# Altium project MEC.PrjPcb (part 2 of 2)

## Sheet Ethernet Interface (ETH).SchDoc
size A4; SheetNumber: 9; SheetTotal: 10
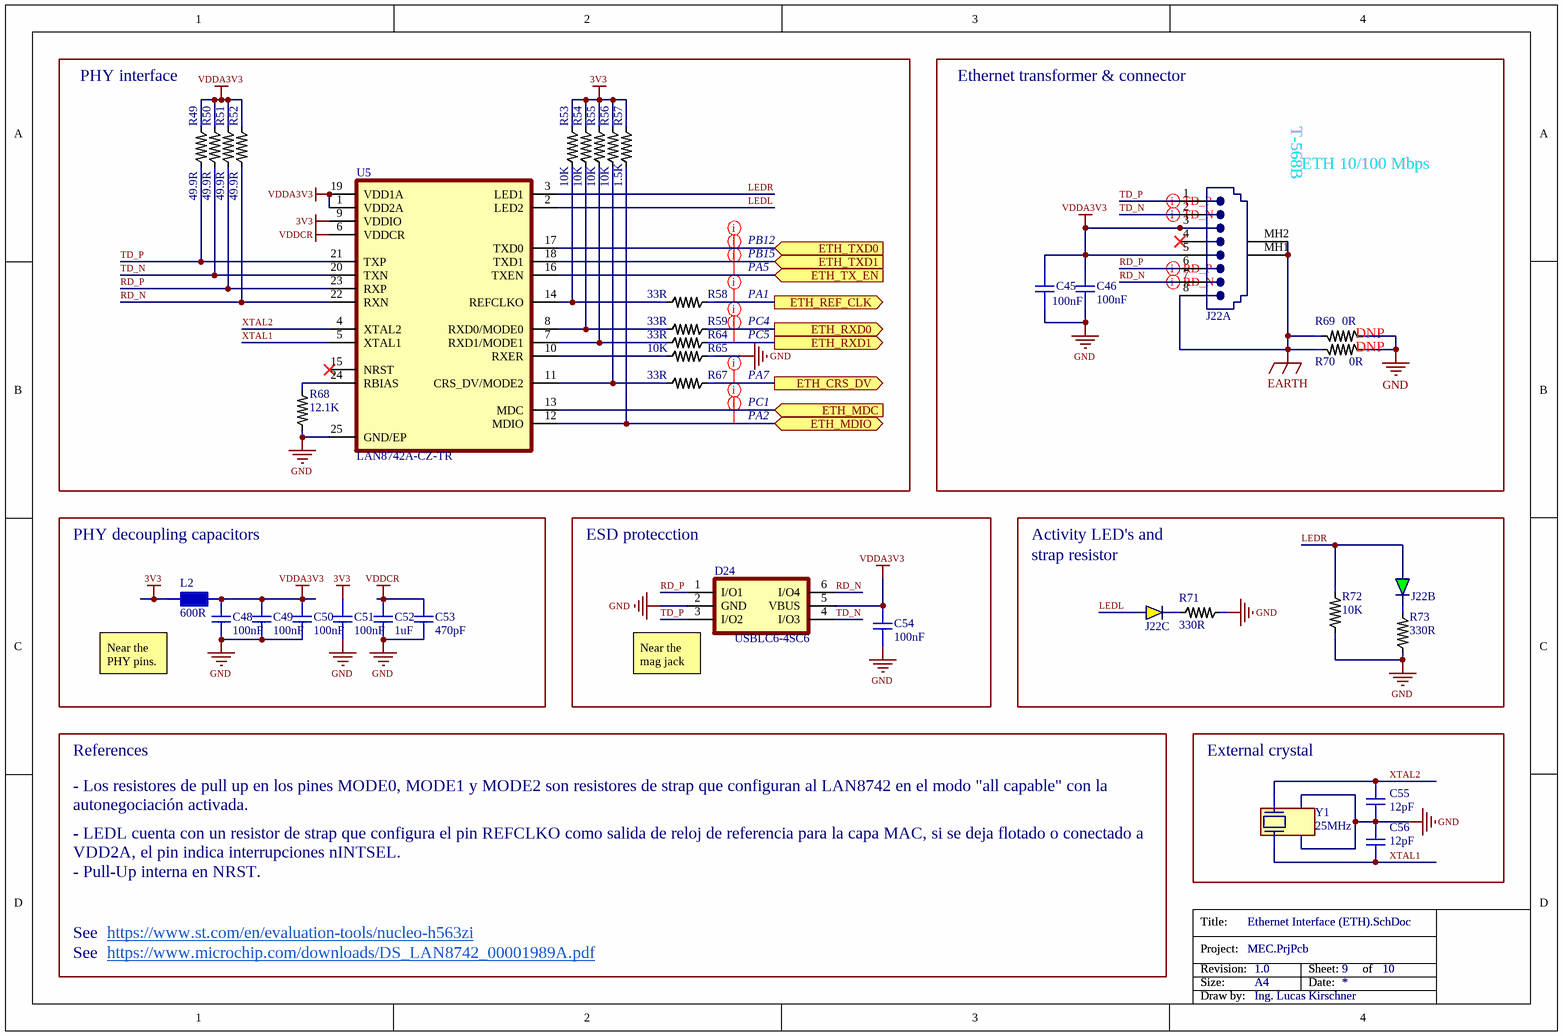
[diagram p5: Ethernet Interface (ETH).SchDoc]

### Parts
C45  value 100nF  [CAPC1005N]  (hidden comment: Multilayer Ceramic Capacitors)
C46  value 100nF  [CAPC1005N]  (hidden comment: Multilayer Ceramic Capacitors)
C48  value 100nF  [CAPC1005N]  (hidden comment: Multilayer Ceramic Capacitors)
C49  value 100nF  [CAPC1005N]  (hidden comment: Multilayer Ceramic Capacitors)
C50  value 100nF  [CAPC1005N]  (hidden comment: Multilayer Ceramic Capacitors)
C51  value 100nF  [CAPC1005N]  (hidden comment: Multilayer Ceramic Capacitors)
C52  value 1uF  [CAPC1005N]  (hidden comment: Multilayer Ceramic Capacitors)
C53  value 470pF  [CAPC1005N]  (hidden comment: Multilayer Ceramic Capacitors)
C54  value 100nF  [CAPC1005N]  (hidden comment: Multilayer Ceramic Capacitors)
C55  value 12pF  [CAPC1005N]  (hidden comment: Multilayer Ceramic Capacitors)
C56  value 12pF  [CAPC1005N]  (hidden comment: Multilayer Ceramic Capacitors)
D24  Part Number: USBLC6-4SC6  [SOT95P280X145-6N]  (hidden comment: ESD Protection Diodes)
J22  Magnetic Jack Ethernet  [RJ45-8P8C-VERT-THT-MAGJACK]  (value not drawn)  (parts A,B,C of 3)
L2  value 600R  [INDC1005N]  (hidden comment: Ferrite Beads)
R49  value 49.9R  [RESC1005N]  (hidden comment: Thick Film Resistors)
R50  value 49.9R  [RESC1005N]  (hidden comment: Thick Film Resistors)
R51  value 49.9R  [RESC1005N]  (hidden comment: Thick Film Resistors)
R52  value 49.9R  [RESC1005N]  (hidden comment: Thick Film Resistors)
R53  value 10K  [RESC1005N]  (hidden comment: Thick Film Resistors)
R54  value 10K  [RESC1005N]  (hidden comment: Thick Film Resistors)
R55  value 10K  [RESC1005N]  (hidden comment: Thick Film Resistors)
R56  value 10K  [RESC1005N]  (hidden comment: Thick Film Resistors)
R57  value 1.5K  [RESC1005N]  (hidden comment: Thick Film Resistors)
R58  value 33R  [RESC1005N]  (hidden comment: Thick Film Resistors)
R59  value 33R  [RESC1005N]  (hidden comment: Thick Film Resistors)
R64  value 33R  [RESC1005N]  (hidden comment: Thick Film Resistors)
R65  value 10K  [RESC1005N]  (hidden comment: Thick Film Resistors)
R67  value 33R  [RESC1005N]  (hidden comment: Thick Film Resistors)
R68  value 12.1K  [RESC1005N]  (hidden comment: Thick Film Resistors)
R69  value 0R  [RESC1005N]  (hidden comment: Thick Film Resistors)  (no BOM)
R70  value 0R  [RESC1005N]  (hidden comment: Thick Film Resistors)  (no BOM)
R71  value 330R  [RESC1005N]  (hidden comment: Thick Film Resistors)
R72  value 10K  [RESC1005N]  (hidden comment: Thick Film Resistors)
R73  value 330R  [RESC1005N]  (hidden comment: Thick Film Resistors)
U5  Part Number: LAN8742A-CZ-TR  [QFN50P400X400X100-25N-D]  (hidden comment: Ethernet PHY)
Y1  value 25MHz  [XTAL3225]  (hidden comment: Crystal)

### Blocks framed on the sheet
PHY interface: R49-R59 R64 R65 R67 R68 U5
PHY decoupling capacitors: C48-C53 L2
ESD protecction: C54 D24
External crystal: C55 C56 Y1

### Ports
ETH_CRS_DV (out, see Main[2B], Microcontroller (MCU)[2A]), ETH_MDC (in, see Main[2B], Microcontroller (MCU)[2C]), ETH_MDIO (bidir, see Main[2B], Microcontroller (MCU)[2A]), ETH_REF_CLK (out, see Main[2B], Microcontroller (MCU)[2A]), ETH_RXD0 (out, see Main[2B], Microcontroller (MCU)[2C]), ETH_RXD1 (out, see Main[2B], Microcontroller (MCU)[2C]), ETH_TX_EN (in, see Main[2B], Microcontroller (MCU)[2A]), ETH_TXD0 (in, see Main[2B], Microcontroller (MCU)[2B]), ETH_TXD1 (in, see Main[2B], Microcontroller (MCU)[2C])

### Nets
3V3: C51.1 L2.1 R53.2 R54.2 R55.2 R56.2 R57.2 U5.9(VDDIO)
EARTH: J22.8 J22.MH1 J22.MH2 R69.2 R70.2
GND: C45.2 C46.2 C48.2 C49.2 C50.2 C51.2 C52.2 C53.2 C54.2 C55.2 C56.1 D24.2(GND) R65.2 R68.1 R69.1 R70.1 R71.2 R72.1 R73.1 U5.25(GND/EP) Y1.2(GND) Y1.4(GND)
VDDA3V3: C45.1 C46.1 C48.1 C49.1 C50.1 C54.1 D24.5(VBUS) J22.3 J22.5 L2.2 R49.2 R50.2 R51.2 R52.2 U5.1(VDD2A) U5.19(VDD1A)
VDDCR: C52.1 C53.1 U5.6(VDDCR)
ETH_CRS_DV: R67.2 ; port ETH_CRS_DV
ETH_MDC: U5.13(MDC) ; port ETH_MDC
ETH_MDIO: R57.1 U5.12(MDIO) ; port ETH_MDIO
ETH_REF_CLK: R58.2 ; port ETH_REF_CLK
ETH_RXD0: R59.2 ; port ETH_RXD0
ETH_RXD1: R64.2 ; port ETH_RXD1
ETH_TX_EN: U5.16(TXEN) ; port ETH_TX_EN
ETH_TXD0: U5.17(TXD0) ; port ETH_TXD0
ETH_TXD1: U5.18(TXD1) ; port ETH_TXD1
LEDL: J22.12 U5.2(LED2)
LEDR: J22.9 R72.2 U5.3(LED1)
RD_N: D24.6(I/O4) J22.7 R52.1 U5.22(RXN)
RD_P: D24.1(I/O1) J22.6 R51.1 U5.23(RXP)
TD_N: D24.4(I/O3) J22.2 R50.1 U5.20(TXN)
TD_P: D24.3(I/O2) J22.1 R49.1 U5.21(TXP)
XTAL1: C56.2 U5.5(XTAL1) Y1.3(OUT/IN)
XTAL2: C55.1 U5.4(XTAL2) Y1.1(IN/OUT)
NetJ22_10: J22.10 R73.2
NetJ22_11: J22.11 R71.1
NetR53_1: R53.1 R58.1 U5.14(REFCLKO)
NetR54_1: R54.1 R59.1 U5.8(RXD0/MODE0)
NetR55_1: R55.1 R64.1 U5.7(RXD1/MODE1)
NetR56_1: R56.1 R67.1 U5.11(CRS_DV/MODE2)
NetR65_1: R65.1 U5.10(RXER)
NetR68_2: R68.2 U5.24(RBIAS)

Not connected (* = marked no-connect by the designer): J22 4*; U5 15(NRST)*

### Layout directives
net class RMII: ETH_CRS_DV, ETH_MDC, ETH_MDIO, ETH_REF_CLK, ETH_RXD0, ETH_RXD1, ETH_TX_EN, ETH_TXD0, ETH_TXD1
differential pair; differential pair class MDI_TD: TD_N, TD_P
differential pair; differential pair class MDI_RD: RD_N, RD_P

### Notes on the sheet
- Ethernet transformer & connector
- (near J22) ETH 10/100 Mbps
- (near J22) T-568B
- PB12
- PA1
- PB15
- PA5
- PA7
- PC4
- PC5
- (near R69) DNP
- DNP
- PC1
- PA2
- Activity LED's and
- strap resistor
- Near the PHY pins.
- (near D24) Near the mag jack
- References
- - Los resistores de pull up en los pines MODE0, MODE1 y MODE2 son resistores de strap que configuran al LAN8742 en el modo "all capable" con la autonegociación activada.
- - LEDL cuenta con un resistor de strap que configura el pin REFCLKO como salida de reloj de referencia para la capa MAC, si se deja flotado o conectado a VDD2A, el pin indica interrupciones nINTSEL.
- - Pull-Up interna en NRST.
- Title:
- See
- https://www.microchip.com/downloads/DS_LAN8742_00001989A.pdf <https://ww1.microchip.com/downloads/aemDocuments/documents/OTH/ProductDocuments/DataSheets/DS_LAN8742_00001989A.pdf>
- https://www.st.com/en/evaluation-tools/nucleo-h563zi
- Project:
- Revision:
- Size:
- A4
- Sheet:
- Date:
- of
- Draw by:

### Library data of the parts
C45 C46 C48-C51 C54 = C-MLCC-100nF-50V-10%-0402: as C64 on sheet Microcontroller (MCU); Mounting Type: SMT; Mouser Part #: 603-CC402KRX5R9BB104; Digikey Part #: 311-3342-1-ND; JLCPCB Part #: C105882
C52 = C-MLCC-1uF-50V-10%-0402: Multilayer Ceramic Capacitors MLCC - SMD/SMT 50V 1uF X5R 0402 10% HI CV; Part Number: CC0402KRX5R9BB105; Manufacturer: YAGEO; Mounting Type: SMT; Mouser Part #: 603-CC0402KX5R9BB105; Digikey Part #: 13-CC0402KRX5R9BB105CT-ND; JLCPCB Part #: C7500380
C53 = C-MLCC-470pF-50V-10%-0402: Multilayer Ceramic Capacitors MLCC - SMD/SMT 50 V 470pF X7R 0402 10%; Part Number: CC0402KRX7R9BB471; Manufacturer: YAGEO; Mounting Type: SMT; Mouser Part #: 603-CC402KRX7R9BB471; Digikey Part #: 311-1028-1-ND; JLCPCB Part #: C106207
C55 C56 = C-MLCC-12pF-50V-10%-0402: Multilayer Ceramic Capacitors MLCC - SMD/SMT 50 V 12 pF C0G 0402 1%; Part Number: CC0402FRNPO9BN120; Manufacturer: YAGEO; Mounting Type: SMT; Mouser Part #: 603-CC402FRNPO9BN120; Digikey Part #: 311-1641-1-ND; JLCPCB Part #: C326662
D24 = D-USBLC6-4SC6: ESD Protection Diodes / TVS Diodes Low Cap ESD Protect; Manufacturer: STMicroelectronics; Mounting Type: SMT; Mouser Part #: 511-USBLC6-4SC6; Digikey Part #: 497-4492-1-ND; JLCPCB Part #: C558419
J22 = J-RJ45-1P-VERT-MAGJACK-SH-LED-THT: Modular Ethernet Connector Jack (Female) 1x1 Shielded Through Hole With LEDs With Magnetics; Manufacturer: HANRUN; Part Number: HY951180A; Mounting Type: THT; Mouser Part #: 815-ARJ07-111071A; Digikey Part #: 535-12607-ND; JLCPCB Part #: C34677
L2 = L-FB-600R-100MHz-500mA-0402: Ferrite Beads 600 OHM 25% Alternate Sizing Guide Below; Manufacturer: Murata Electronics; Part Number: BLM15AX601SN1D; Mounting Type: SMT; Mouser Part #: 81-BLM15AX601SN1D; Digikey Part #: 490-5441-1-ND; JLCPCB Part #: C76886
R49-R52 = R-THICK-49R9-62.5mW-1%-0402: Thick Film Resistors - SMD General Purpose Chip Resistor 0402, 49.9Ohms, 1%, 1/16W; Part Number: RC0402FR-0749R9L; Manufacturer: YAGEO; Mounting Type: SMT; Mouser Part #: 603-RC0402FR-0749R9L; Digikey Part #: 311-49.9LRCT-ND; JLCPCB Part #: C87044
R53-R56 R65 R72 = R-THICK-10K-62.5mW-1%-0402: as R79 on sheet Microcontroller (MCU); Mounting Type: SMT; Mouser Part #: 603-RC0402FR-0710KL; Digikey Part #: 311-10.0KLRCT-ND; JLCPCB Part #: C60490
R57 = R-THICK-1K5-62.5mW-1%-0402: Thick Film Resistors - SMD General Purpose Chip Resistor 0402, 1.5kOhms, 1%, 1/16W; Part Number: RC0402FR-071K5L; Manufacturer: YAGEO; Mounting Type: SMT; Mouser Part #: 603-RC0402FR-071K5L; Digikey Part #: 311-1.50KLRCT-ND; JLCPCB Part #: C114759
R58 R59 R64 R67 = R-THICK-33R-62.5mW-1%-0402: Thick Film Resistors - SMD General Purpose Chip Resistor 0402, 33Ohms, 1%, 1/16W; Part Number: RC0402FR-0733RL; Manufacturer: YAGEO; Mounting Type: SMT; Mouser Part #: 603-RC0402FR-0733RL; Digikey Part #: 311-33.0LRCT-ND; JLCPCB Part #: C138002
R68 = R-THICK-12K1-62.5mW-1%-0402: Thick Film Resistors - SMD General Purpose Chip Resistor 0402, 12.1kOhms, 1%, 1/16W; Part Number: RC0402FR-0712K1L; Manufacturer: YAGEO; Mounting Type: SMT; Mouser Part #: 603-RC0402FR-0712K1L; Digikey Part #: 311-12.1KLRCT-ND; JLCPCB Part #: C132157
R69 R70 = R-THICK-0R-62.5mW-1%-0402: Thick Film Resistors - SMD General Purpose Chip Resistor 0402, 0Ohms, 1%, 1/16W; Part Number: RC0402FR-070RL; Manufacturer: YAGEO; Mounting Type: SMT; Mouser Part #: 603-RC0402FR-070RL; Digikey Part #: 311-0.0LRCT-ND; JLCPCB Part #: C106231
R71 R73 = R-THICK-330R-62.5mW-1%-0402: Thick Film Resistors - SMD General Purpose Chip Resistor 0402, 330Ohms, 1%, 1/16W; Part Number: RC0402FR-07330RL; Manufacturer: YAGEO; Mounting Type: SMT; Mouser Part #: 603-RC0402FR-07330RL; Digikey Part #: 311-330LRCT-ND; JLCPCB Part #: C105875
U5 = U-LAN8742A: Ethernet PHY transceiver 10/100-Mbps; Manufacturer: Microchip; Mounting Type: SMT; Mouser Part #: 579-LAN8742A-CZ-TR; Digikey Part #: LAN8742A-CZ-CT-ND; JLCPCB Part #: C621424
Y1 = Y-XTAL-25MHz-12pF-20ppm-3225-SMT: Crystals 25MHz 12pF 20ppm -40C +125C; Manufacturer: ECS; Part Number: ECS-250-12-33Q-JES-TR; Mounting Type: SMT; Mouser Part #: 520-250-12-33Q-JEST; Digikey Part #: XC2151CT-ND; JLCPCB Part #: C91750

## Sheet Power Supply (PWR).SchDoc
size A4; SheetNumber: 4; SheetTotal: 10
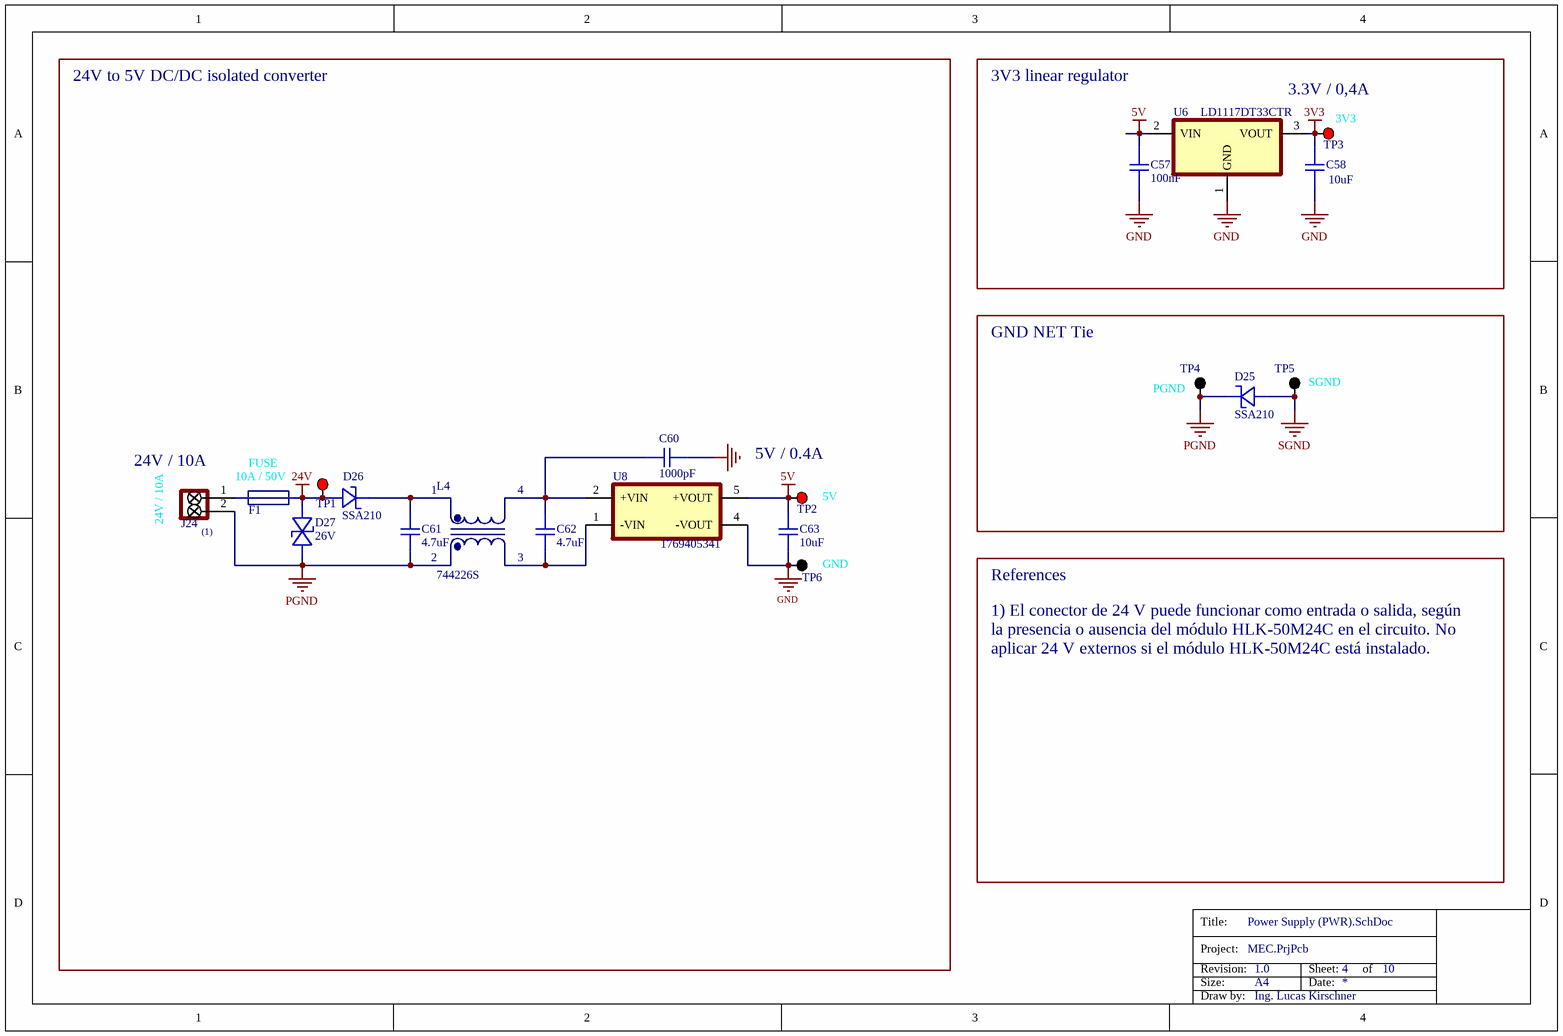
[diagram p6: Power Supply (PWR).SchDoc]

### Parts
C57  value 100nF  [CAPC1005N]  (hidden comment: Multilayer Ceramic Capacitors)
C58  value 10uF  [CAPC2012N]  (hidden comment: Multilayer Ceramic Capacitors)
C60  value 1000pF  [CAPC3216N]  (hidden comment: Multilayer Ceramic Capacitors)
C61  value 4.7uF  [CAPC2012N]  (hidden comment: Multilayer Ceramic Capacitors)
C62  value 4.7uF  [CAPC2012N]  (hidden comment: Multilayer Ceramic Capacitors)
C63  value 10uF  [CAPC2012N]  (hidden comment: Multilayer Ceramic Capacitors)
D25  Part Number: SSA210  [DIOM5026X229N]  (hidden comment: Schottky Diodes)
D26  Part Number: SSA210  [DIOM5026X229N]  (hidden comment: Schottky Diodes)
D27  value 26V  [DIOM5026X229N_NP]  (hidden comment: ESD Protection Diodes)
F1  Cartridge Fuse  [RESC3216N]  (value not drawn)
J24  Terminal Blocks  [CONB_FIX508P-2N]  (value not drawn)
L4  Part Number: 744226S  [INDC6X9.2-4N]  (hidden comment: Common Mode Chokes)
TP1  Test point  [TP-1MM]  (value not drawn)  (no BOM)
TP2  Test point  [TP-1MM]  (value not drawn)  (no BOM)
TP3  Test point  [TP-1MM]  (value not drawn)  (no BOM)
TP4  Test point  [TPH1.6D3.2BLK]  (value not drawn)
TP5  Test point  [TPH1.6D3.2BLK]  (value not drawn)
TP6  Test point  [TPH1.6D3.2BLK]  (value not drawn)
U6  Part Number: LD1117DT33CTR  [TO252P170-3N]  (hidden comment: LDO Voltage Regulators)
U8  Part Number: 1769405341  [PKG10.8X12.8-5N]  (hidden comment: Isolated DC/DC Converter)

### Blocks framed on the sheet
GND NET Tie: D25 TP4 TP5

### Nets
3V3: C58.1 TP3.1 U6.3(VOUT)
5V: C57.1 C63.1 TP2.1 U6.2(VIN) U8.5(+VOUT)
24V: D26.A D27.2 F1.2 TP1.1
GND: C57.2 C58.2 C60.2 C63.2 TP6.1 U6.1(GND) U8.4(-VOUT)
PGND: C61.2 D25.C D27.1 J24.2 L4.2 TP4.1
SGND: D25.A TP5.1
NetC60_1: C60.1 C62.1 L4.4 U8.2(+VIN)
NetC61_1: C61.1 D26.C L4.1
NetC62_2: C62.2 L4.3 U8.1(-VIN)
NetF1_1: F1.1 J24.1

### Notes on the sheet
- 24V to 5V DC/DC isolated converter
- 3V3 linear regulator
- 3.3V / 0,4A
- (near TP3) 3V3
- (near TP5) SGND
- (near TP4) PGND
- (near J24) 24V / 10A
- (near F1) 10A / 50V
- (near F1) FUSE
- 5V / 0.4A
- (near TP2) 5V
- (near J24) (1)
- (near TP6) GND
- References
- 1) El conector de 24 V puede funcionar como entrada o salida, según la presencia o ausencia del módulo HLK-50M24C en el circuito. No aplicar 24 V externos si el módulo HLK-50M24C está instalado.
- Title:
- Project:
- Revision:
- Size:
- A4
- Sheet:
- Date:
- of
- Draw by:

### Library data of the parts
C57 = C-MLCC-100nF-50V-10%-0402: as C64 on sheet Microcontroller (MCU); Mounting Type: SMT; Mouser Part #: 603-CC402KRX5R9BB104; Digikey Part #: 311-3342-1-ND; JLCPCB Part #: C105882
C58 C63 = C-MLCC-10uF-16V-10%-0805: Multilayer Ceramic Capacitors MLCC - SMD/SMT 16V 10uF X5R 0805 10%; Part Number: CC0805KKX5R7BB106; Manufacturer: YAGEO; Mounting Type: SMT; Mouser Part #: 603-CC805KKX5R7BB106; Digikey Part #: 311-1865-1-ND; JLCPCB Part #: C89827
C60 = C-MLCC-1000pF-2kV-10%-1206: Multilayer Ceramic Capacitors MLCC - SMD/SMT 2kV 1000pF X7R 1206 10%; Part Number: CC1206KKX7RDBB102; Manufacturer: YAGEO; Mounting Type: SMT; Mouser Part #: 603-CC206KKX7RDBB102; Digikey Part #: 311-1487-1-ND; JLCPCB Part #: C23631
C61 C62 = C-MLCC-4.7uF-50V-10%-0805: Multilayer Ceramic Capacitors MLCC - SMD/SMT 50V 4.7uF X5R 0805 10%; Part Number: CC0805KKX5R9BB475; Manufacturer: YAGEO; Mounting Type: SMT; Mouser Part #: 603-CC0805KKX59BB475; Digikey Part #: 13-CC0805KKX5R9BB475CT-ND; JLCPCB Part #: C2897302
D25 D26 = D-SCH-2A-100V-SMA: Schottky Diodes & Rectifiers 2A 100V SMA; Manufacturer: onsemi; Mounting Type: SMT; Mouser Part #: 512-SSA210; Digikey Part #: SSA210CT-ND; JLCPCB Part #: C14996
D27 = D-TVS-400W-26V-SMA-BI: ESD Protection Diodes / TVS Diodes 400W 26V 5% Bi-Directional; Part Number: SMAJ26CA; Manufacturer: Littelfuse; Mounting Type: SMT; Mouser Part #: 576-SMAJ26CA; Digikey Part #: 18-SMAJ26CACT-ND; JLCPCB Part #: C173517
F1 = F-1206-10A-50V-SMT: Surface Mount Fuses 1206 high-current met-foil. 10A; Manufacturer: Bourns; Part Number: SF-1206HH1000R-2; Mounting Type: SMT; Mouser Part #: 652-SF-1206HH1000R-2; Digikey Part #: 118-SF-1206HH1000R-2CT-ND; JLCPCB Part #: C136354
J24 = J-02-5P08-TERM-F-VERT-TH: Pluggable Terminal Blocks 2 Pos 5.08mm pitch Through Hole Header; Manufacturer: Adam Tech; Part Number: EBA-02-D-BU-01; Mouser Part #: 737-EBA-02-D-BU-01; Mounting Type: THT; Digikey Part #: ED2609-ND; JLCPCB Part #: C8475
L4 = L-CMC-10uH-1.6A-TH: Common Mode Chokes / Filters WE-SL2 SMD Sectional 2x10uH 1600mA; Manufacturer: Wurth Elektronik; Mounting Type: SMT; Mouser Part #: 710-744226S; Digikey Part #: 732-1476-1-ND; JLCPCB Part #: C878356
TP1-TP3 = TP-1MM-SMD: Test point, 1mm, exposed pad; Mounting Type: SMD; JLCPCB Part #: C5199810
TP4-TP6 = TP-LOOP-D3.2-P1.60-BLK-TH: Test point black, Mtg Hole 1.6, loop 3.2mm; Part Number: 5006; Manufacturer: Keystone Electronics; Mounting Type: THT; Mouser Part #: 534-5006; Digikey Part #: 36-5006-ND; JLCPCB Part #: C2906764
U6 = U-LD1117DT33CTR: LDO Voltage Regulators 3.3V 0.8A Positive; Manufacturer: STMicroelectronics; Mounting Type: SMT; Mouser Part #: 511-LD1117DT33C-TR; Digikey Part #: 497-1235-1-ND; JLCPCB Part #: C36395
U8 = U-1769405341-SMD: Isolated DC/DC Converters - SMD WPME-FISM SMT-8 Modu 24Vin 5Vout 2W 3kV; Manufacturer: Wurth Elektronik; Mounting Type: SMT; Mouser Part #: 710-1769405341; Digikey Part #: 732-1769405341CT-ND; JLCPCB Part #: C6978530

## Sheet Industrial Serial Comm (RS485).SchDoc
size A4; SheetNumber: 7; SheetTotal: 10
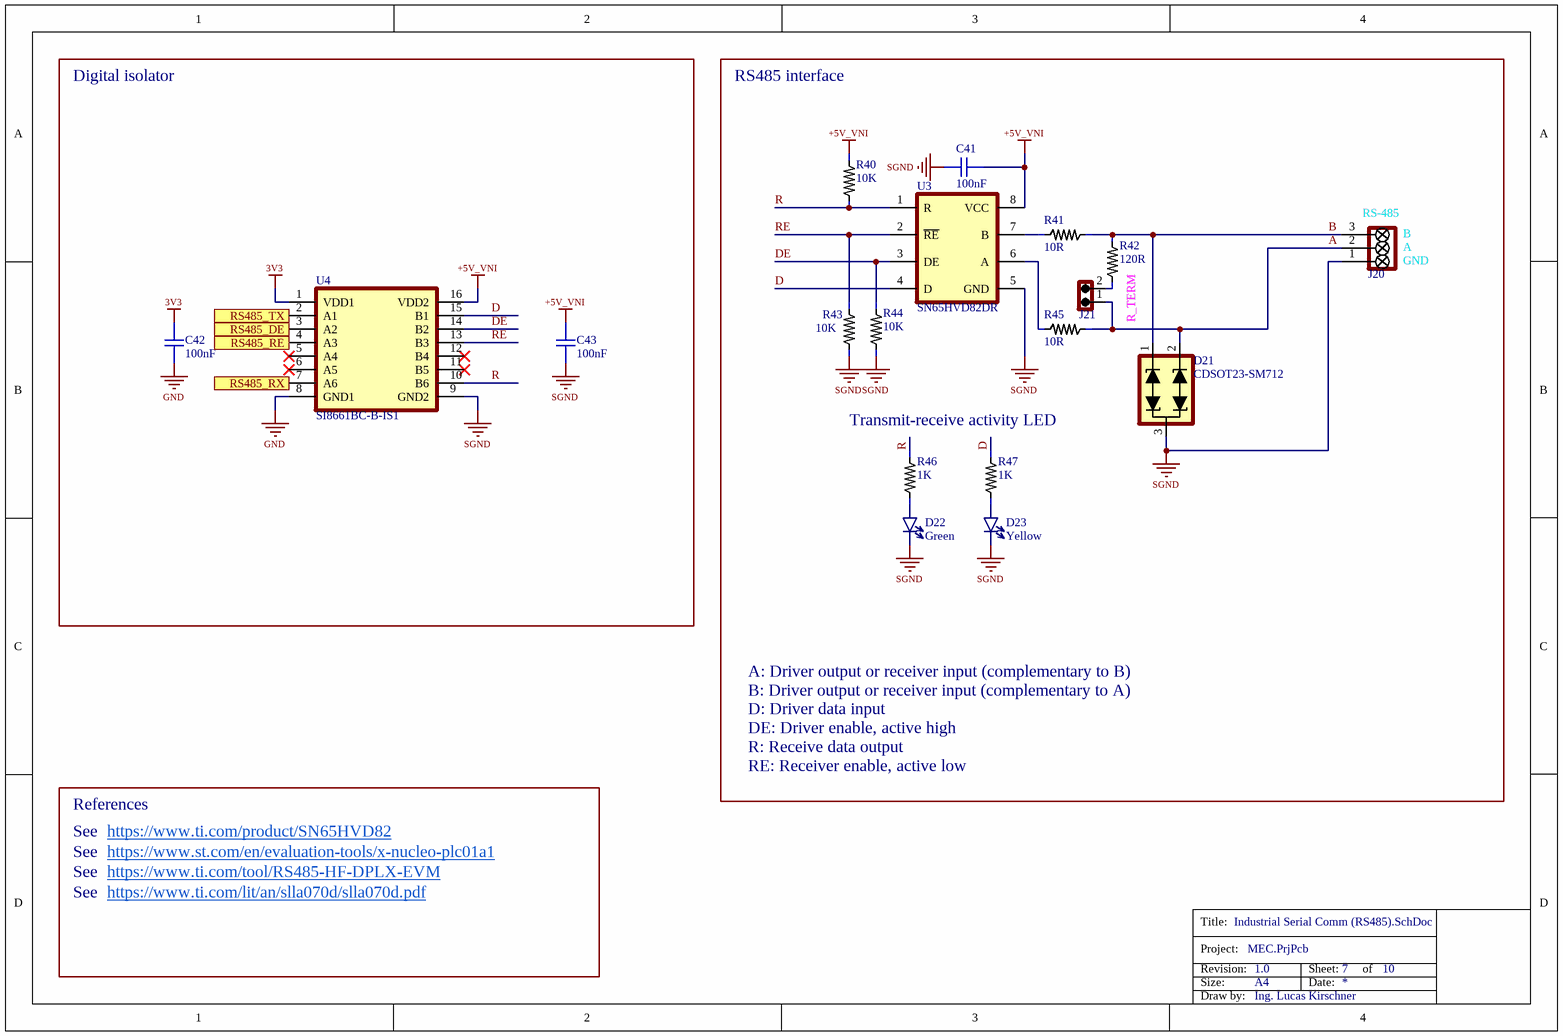
[diagram p7: Industrial Serial Comm (RS485).SchDoc]

### Parts
C41  value 100nF  [CAPC1005N]  (hidden comment: Multilayer Ceramic Capacitors)
C42  value 100nF  [CAPC1005N]  (hidden comment: Multilayer Ceramic Capacitors)
C43  value 100nF  [CAPC1005N]  (hidden comment: Multilayer Ceramic Capacitors)
D21  Part Number: CDSOT23-SM712  [SOT95P230X117-3N]  (hidden comment: ESD Protection Diodes)
D22  value Green  [LEDC1608X80N_GREEN]  (hidden comment: Single Color LED)
D23  value Yellow  [LEDC1608X80N_YELLOW]  (hidden comment: Single Color LED)
J20  Terminal Blocks  [CONB_FIX508P-3N]  (value not drawn)
J21  Male straight header  [CONH_ML254P-2N]  (value not drawn)
R40  value 10K  [RESC1005N]  (hidden comment: Thick Film Resistors)
R41  value 10R  [RESC2012N]  (hidden comment: Thick Film Resistors)
R42  value 120R  [RESC1005N]  (hidden comment: Thick Film Resistors)
R43  value 10K  [RESC1005N]  (hidden comment: Thick Film Resistors)
R44  value 10K  [RESC1005N]  (hidden comment: Thick Film Resistors)
R45  value 10R  [RESC2012N]  (hidden comment: Thick Film Resistors)
R46  value 1K  [RESC1005N]  (hidden comment: Thick Film Resistors)
R47  value 1K  [RESC1005N]  (hidden comment: Thick Film Resistors)
U3  Part Number: SN65HVD82DR  [SOIC127P600X175-8N]  (hidden comment: RS-485 Interface)
U4  Part Number: SI8661BC-B-IS1  [SOIC127P1030X265-16N]  (hidden comment: Digital Isolators)

### Blocks framed on the sheet
Digital isolator: C42 C43 U4

### Ports
RS485_DE (in, see Main[3B], Microcontroller (MCU)[2A]), RS485_RE (in, see Main[3B], Microcontroller (MCU)[2A]), RS485_RX (out, see Main[3B], Microcontroller (MCU)[2B]), RS485_TX (in, see Main[3B], Microcontroller (MCU)[2B])

### Nets
3V3: C42.1 U4.1(VDD1)
+5V_VNI: C41.1 C43.1 R40.2 U3.8(VCC) U4.16(VDD2)
GND: C42.2 U4.8(GND1)
SGND: C41.2 C43.2 D21.3 D22.C D23.C J20.1 R43.1 R44.1 U3.5(GND) U4.9(GND2)
A: D21.2 J20.2 J21.1 R45.2
B: D21.1 J20.3 R41.2 R42.2
D: R47.2 U3.4(D) U4.15(B1)
DE: R44.2 U3.3(DE) U4.14(B2)
R: R40.1 R46.2 U3.1(R) U4.10(B6)
RE: R43.2 U3.2(~{RE}) U4.13(B3)
RS485_DE: U4.3(A2) ; port RS485_DE
RS485_RE: U4.4(A3) ; port RS485_RE
RS485_RX: U4.7(A6) ; port RS485_RX
RS485_TX: U4.2(A1) ; port RS485_TX
NetD22_A: D22.A R46.1
NetD23_A: D23.A R47.1
NetJ21_2: J21.2 R42.1
NetR41_1: R41.1 U3.7(B)
NetR45_1: R45.1 U3.6(A)

Not connected (* = marked no-connect by the designer): U4 5(A4)* 6(A5)* 11(B5)* 12(B4)*

### Notes on the sheet
- RS485 interface
- (near J20) RS-485
- (near J20) B
- (near J20) A
- (near J20) GND
- (near R42) R_TERM
- Transmit-receive activity LED
- A: Driver output or receiver input (complementary to B)
  B: Driver output or receiver input (complementary to A)
  D: Driver data input
  DE: Driver enable, active high
  R: Receive data output
  RE: Receiver enable, active low
- References
- See
- https://www.ti.com/product/SN65HVD82
- https://www.st.com/en/evaluation-tools/x-nucleo-plc01a1
- https://www.ti.com/tool/RS485-HF-DPLX-EVM
- https://www.ti.com/lit/an/slla070d/slla070d.pdf
- Title:
- Project:
- Revision:
- Size:
- A4
- Sheet:
- Date:
- of
- Draw by:

### Library data of the parts
C41-C43 = C-MLCC-100nF-50V-10%-0402: Multilayer Ceramic Capacitors MLCC - SMD/SMT 50 V 0.1uF X7R 0402 10%; Part Number: CC0402KRX5R9BB104; Manufacturer: YAGEO; Mounting Type: SMT; Mouser Part #: 603-CC402KRX5R9BB104; Digikey Part #: 311-3342-1-ND; JLCPCB Part #: C105882
D21 = D-CDSOT23-SM712: ESD Protection Diodes / TVS Diodes SOT-23 7V400W Low Capacitance; Manufacturer: Bourns; Mounting Type: SMT; Mouser Part #: 652-CDSOT23-SM712; Digikey Part #: CDSOT23-SM712CT-ND; JLCPCB Part #: C5122012
D22 = D-LED-GREEN-2V-20mA-0603: Standard Single Color LEDs 0603 Green; Part Number: LTST-C190KGKT; Manufacturer: LITEON; Mounting Type: SMT; Mouser Part #: 859-LTST-C190KGKT; Digikey Part #: 160-1435-1-ND; JLCPCB Part #: C125094
D23 = D-LED-YELLOW-2V-20mA-0603: Standard Single Color LEDs 0603 Yellow; Part Number: LTST-C190KSKT; Manufacturer: LITEON; Mounting Type: SMT; Mouser Part #: 859-LTST-C190KSKT; Digikey Part #: 160-1437-1-ND; JLCPCB Part #: C125095
J20 = J-03-5P08-TERM-F-VERT-TH: Pluggable Terminal Blocks 3 Pos 5.08mm pitch Through Hole Header; Manufacturer: Adam Tech; Part Number: EBA-03-D-BU-01; Mouser Part #: 737-EBA-03-D-BU-01; Mounting Type: THT; Digikey Part #: ED2610-ND; JLCPCB Part #: C8483
J21 = J-02-2P54-HDR-M-VERT-TH: Male straight header, 1 row, 2 positions, 2.54mm pitch, through-hole; Part Number: 10129378-902001BLF; Manufacturer: Amphenol FCI; Mounting Type: THT; Mouser Part #: 649-1012937890201BLF; Digikey Part #: 10129378-902001BLF-ND; JLCPCB Part #: C3324910
R40 R43 R44 = R-THICK-10K-62.5mW-1%-0402: Thick Film Resistors - SMD General Purpose Chip Resistor 0402, 10kOhms, 1%, 1/16W; Part Number: RC0402FR-0710KL; Manufacturer: YAGEO; Mounting Type: SMT; Mouser Part #: 603-RC0402FR-0710KL; Digikey Part #: 311-10.0KLRCT-ND; JLCPCB Part #: C60490
R41 R45 = R-THICK-HP-10R-500mW-1%-0805: Thick Film Resistors - SMD High Power Chip Resistor 0805, 10Ohms, 1%, 1/2W; Part Number: CRCW080510R0FKEAHP; Manufacturer: Vishay; Mouser Part #: 71-CRCW080510R0FKEAH; Digikey Part #: 541-10.0TCT-ND; JLCPCB Part #: C844598; Mounting Type: SMT
R42 = R-THICK-120R-62.5mW-1%-0402: Thick Film Resistors - SMD General Purpose Chip Resistor 0402, 120Ohms, 1%, 1/16W; Part Number: RC0402FR-07120RL; Manufacturer: YAGEO; Mounting Type: SMT; Mouser Part #: 603-RC0402FR-07120RL; Digikey Part #: 311-120LRCT-ND; JLCPCB Part #: C114758
R46 R47 = R-THICK-1K-62.5mW-1%-0402: Thick Film Resistors - SMD General Purpose Chip Resistor 0402, 1kOhms, 1%, 1/16W; Part Number: RC0402FR-071KL; Manufacturer: YAGEO; Mounting Type: SMT; Mouser Part #: 603-RC0402FR-071KL; Digikey Part #: 311-1.00KLRCT-ND; JLCPCB Part #: C106235
U3 = U-SN65HVD82DR: RS-485 Interface IC 5V-Supply; Manufacturer: Texas Instruments; Mounting Type: SMT; Mouser Part #: 595-SN65HVD82DR; Digikey Part #: 296-35043-1-ND; JLCPCB Part #: C73631
U4 = U-SI8661BC-B-IS1: Digital Isolators 3.75 kV 5 forward & 1 reverse 6-channel isolator; Manufacturer: Skyworks; Mounting Type: SMT; Mouser Part #: 634-SI8661BC-B-IS1; Digikey Part #: 336-2120-5-ND; JLCPCB Part #: C528656

## Sheet RF Transceiver Module (RF).SchDoc
size A4; SheetNumber: 8; SheetTotal: 10
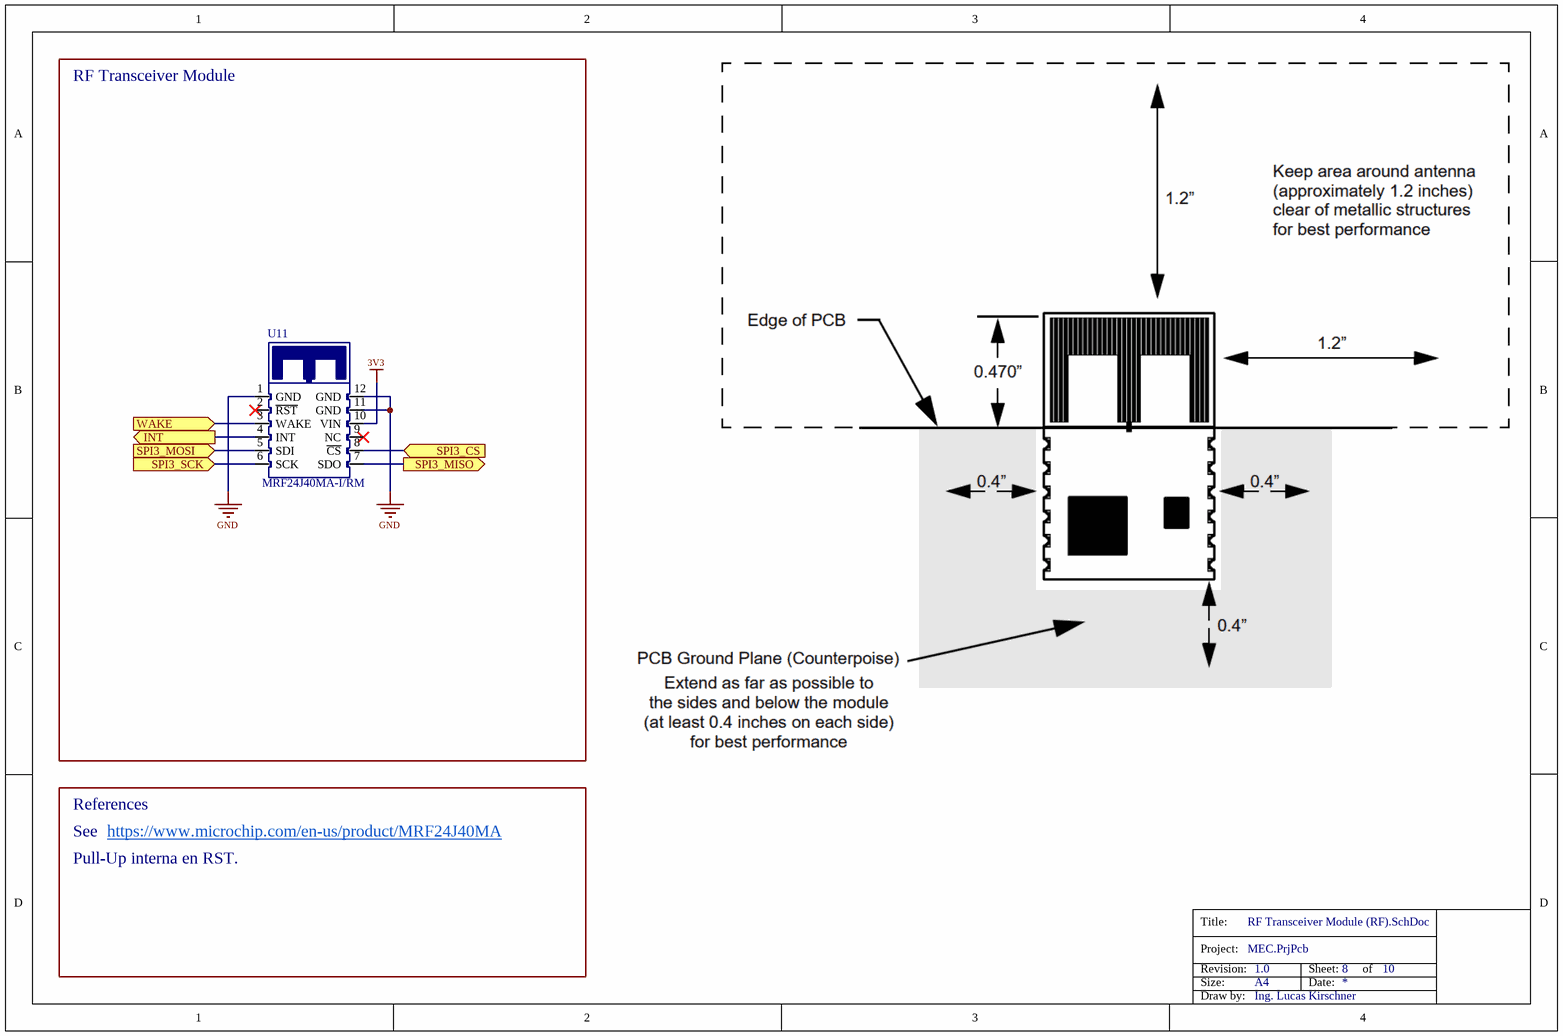
[diagram p8: RF Transceiver Module (RF).SchDoc]

### Parts
U11  Part Number: MRF24J40MA-I/RM  [PKG1100X700-12N]  (hidden comment: RF Transceiver Module)

### Blocks framed on the sheet
RF Transceiver Module: U11

### Ports
INT (out, see Main[2C], Microcontroller (MCU)[2A]), SPI3_CS (in, see Main[2C], Microcontroller (MCU)[2B]), SPI3_MISO (out, see Main[2C], Microcontroller (MCU)[2C]), SPI3_MOSI (in, see Main[2C], Microcontroller (MCU)[2C]), SPI3_SCK (in, see Main[2C], Microcontroller (MCU)[2C]), WAKE (in, see Main[2C], Microcontroller (MCU)[2C])

### Nets
3V3: U11.10(VIN)
GND: U11.1(GND) U11.11(GND) U11.12(GND)
INT: U11.4(INT) ; port INT
SPI3_CS: U11.8(~{CS}) ; port SPI3_CS
SPI3_MISO: U11.7(SDO) ; port SPI3_MISO
SPI3_MOSI: U11.5(SDI) ; port SPI3_MOSI
SPI3_SCK: U11.6(SCK) ; port SPI3_SCK
WAKE: U11.3(WAKE) ; port WAKE

Not connected (* = marked no-connect by the designer): U11 2(~{RST})* 9(NC)*

### Notes on the sheet
- References
- See
- https://www.microchip.com/en-us/product/MRF24J40MA
- Pull-Up interna en RST.
- Title:
- Project:
- Revision:
- Size:
- A4
- Sheet:
- Date:
- of
- Draw by:

### Library data of the parts
U11 = U-MRF24J40MA: Zigbee Modules - 802.15.4 2.4GHz IEEE 802.15.4 Transceiver Module; Manufacturer: Microchip; Mounting Type: SMT; Mouser Part #: 579-MRF24J40MA-I/RM; Digikey Part #: MRF24J40MA-I/RM-ND; JLCPCB Part #: C641083

## Sheet Block diagram.SchDoc
size A4; SheetNumber: 2; SheetTotal: 10
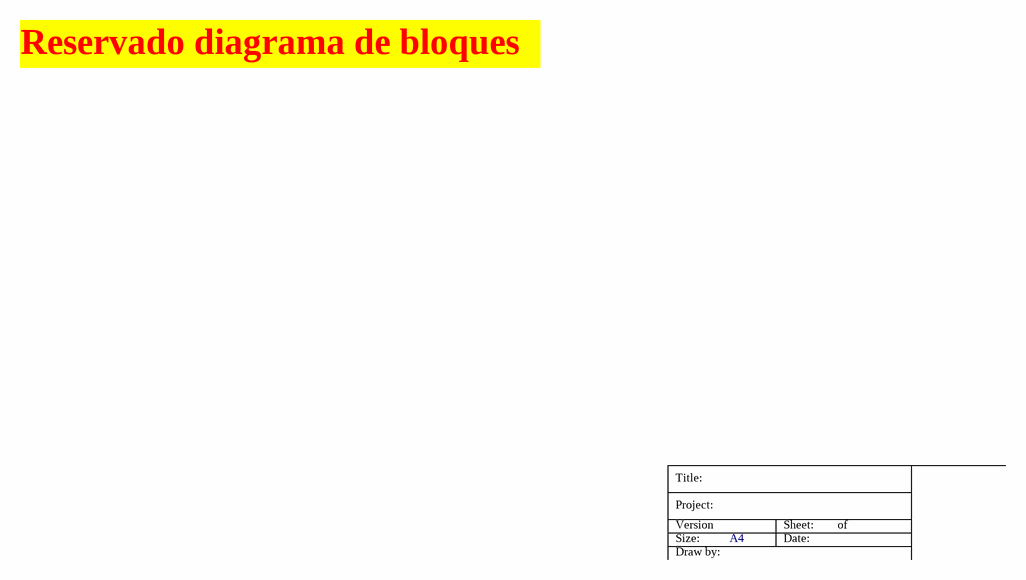
[diagram p9: Block diagram.SchDoc]

### Notes on the sheet
- Reservado diagrama de bloques
- Title:
- Project:
- Version
- Size:
- A4
- Sheet:
- Date:
- of
- Draw by:

## Nets that join several sheets
3V3: Microcontroller (MCU) (20 pins), Ethernet Interface (ETH) (8 pins), Power Supply (PWR) (C58.1 TP3.1 U6.3), Industrial Serial Comm (RS485) (C42.1 U4.1), RF Transceiver Module (RF) (U11.10)
24V: Digital Input (DIN) (10 pins), Digital Output (DOUT) (C15.1 U2.37), Power Supply (PWR) (D26.A D27.2 F1.2 TP1.1)
+5V_VNI: Microcontroller (MCU) (C67.1 U10.16), Digital Output (DOUT) (14 pins), Industrial Serial Comm (RS485) (5 pins)
GND: Microcontroller (MCU) (38 pins), Ethernet Interface (ETH) (22 pins), Power Supply (PWR) (7 pins), Industrial Serial Comm (RS485) (C42.2 U4.8), RF Transceiver Module (RF) (U11.1 U11.11 U11.12)
PGND: Digital Input (DIN) (8 pins), Digital Output (DOUT) (8 pins), Power Supply (PWR) (6 pins)
SGND: Microcontroller (MCU) (C67.2 U10.9), Digital Input (DIN) (30 pins), Digital Output (DOUT) (22 pins), Power Supply (PWR) (D25.A TP5.1), Industrial Serial Comm (RS485) (10 pins)
CS1: Microcontroller (MCU) (U10.15), Digital Input (DIN) (R15.1)
CS2: Microcontroller (MCU) (U10.11), Digital Output (DOUT) (R26.1)
ETH_CRS_DV: Microcontroller (MCU) (U9.23), Ethernet Interface (ETH) (R67.2)
ETH_MDC: Microcontroller (MCU) (U9.9), Ethernet Interface (ETH) (U5.13)
ETH_MDIO: Microcontroller (MCU) (U9.16), Ethernet Interface (ETH) (R57.1 U5.12)
ETH_REF_CLK: Microcontroller (MCU) (U9.15), Ethernet Interface (ETH) (R58.2)
ETH_RXD0: Microcontroller (MCU) (U9.24), Ethernet Interface (ETH) (R59.2)
ETH_RXD1: Microcontroller (MCU) (U9.25), Ethernet Interface (ETH) (R64.2)
ETH_TX_EN: Microcontroller (MCU) (U9.21), Ethernet Interface (ETH) (U5.16)
ETH_TXD0: Microcontroller (MCU) (U9.33), Ethernet Interface (ETH) (U5.17)
ETH_TXD1: Microcontroller (MCU) (U9.36), Ethernet Interface (ETH) (U5.18)
INT: Microcontroller (MCU) (U9.14), RF Transceiver Module (RF) (U11.4)
MISO: Microcontroller (MCU) (U10.10), Digital Input (DIN) (C14.1 R17.1), Digital Output (DOUT) (C37.1 R28.1)
MOSI: Microcontroller (MCU) (U10.13), Digital Input (DIN) (R14.1), Digital Output (DOUT) (R25.1)
RS485_DE: Microcontroller (MCU) (U9.43), Industrial Serial Comm (RS485) (U4.3)
RS485_RE: Microcontroller (MCU) (U9.42), Industrial Serial Comm (RS485) (U4.4)
RS485_RX: Microcontroller (MCU) (U9.44), Industrial Serial Comm (RS485) (U4.7)
RS485_TX: Microcontroller (MCU) (U9.45), Industrial Serial Comm (RS485) (U4.2)
SCK: Microcontroller (MCU) (U10.12), Digital Input (DIN) (R16.1), Digital Output (DOUT) (R27.1)
SPI3_CS: Microcontroller (MCU) (U9.50), RF Transceiver Module (RF) (U11.8)
SPI3_MISO: Microcontroller (MCU) (U9.52), RF Transceiver Module (RF) (U11.7)
SPI3_MOSI: Microcontroller (MCU) (U9.53), RF Transceiver Module (RF) (U11.5)
SPI3_SCK: Microcontroller (MCU) (U9.51), RF Transceiver Module (RF) (U11.6)
VNI_OUT_EN: Microcontroller (MCU) (U10.14), Digital Output (DOUT) (R21.1)
WAKE: Microcontroller (MCU) (U9.54), RF Transceiver Module (RF) (U11.3)

## Assembly variants
All: all parts fitted
JLCPCB: not fitted J1 J2 J3 J4 J5 J6 J7 J8 J21 J25 TP4 TP5 TP6 U1 U2 U8 U11
PCBWAY: not fitted J1 J2 J3 J4 J5 J6 J7 J8 J21 J25 TP4 TP5 TP6 U11